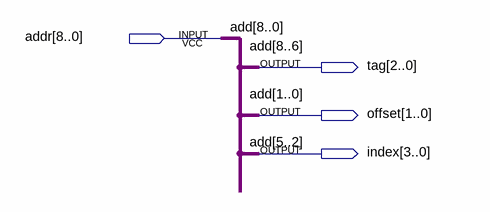
[diagram p0: schematic sheet]
// Quartus schematic Addr_Parser.bdf as structural Verilog: 0 symbols, 4 pins
module Addr_Parser (
  input  [8:0] addr,
  output [2:0] tag,
  output [1:0] offset,
  output [3:0] index
);


  assign index = addr[5:2];
  assign offset = addr[1:0];
  assign tag = addr[8:6];

  // Other names for the same wires on the sheet: add[8:0] = addr
endmodule
